# Altium project MiniDisplay.PrjPCB
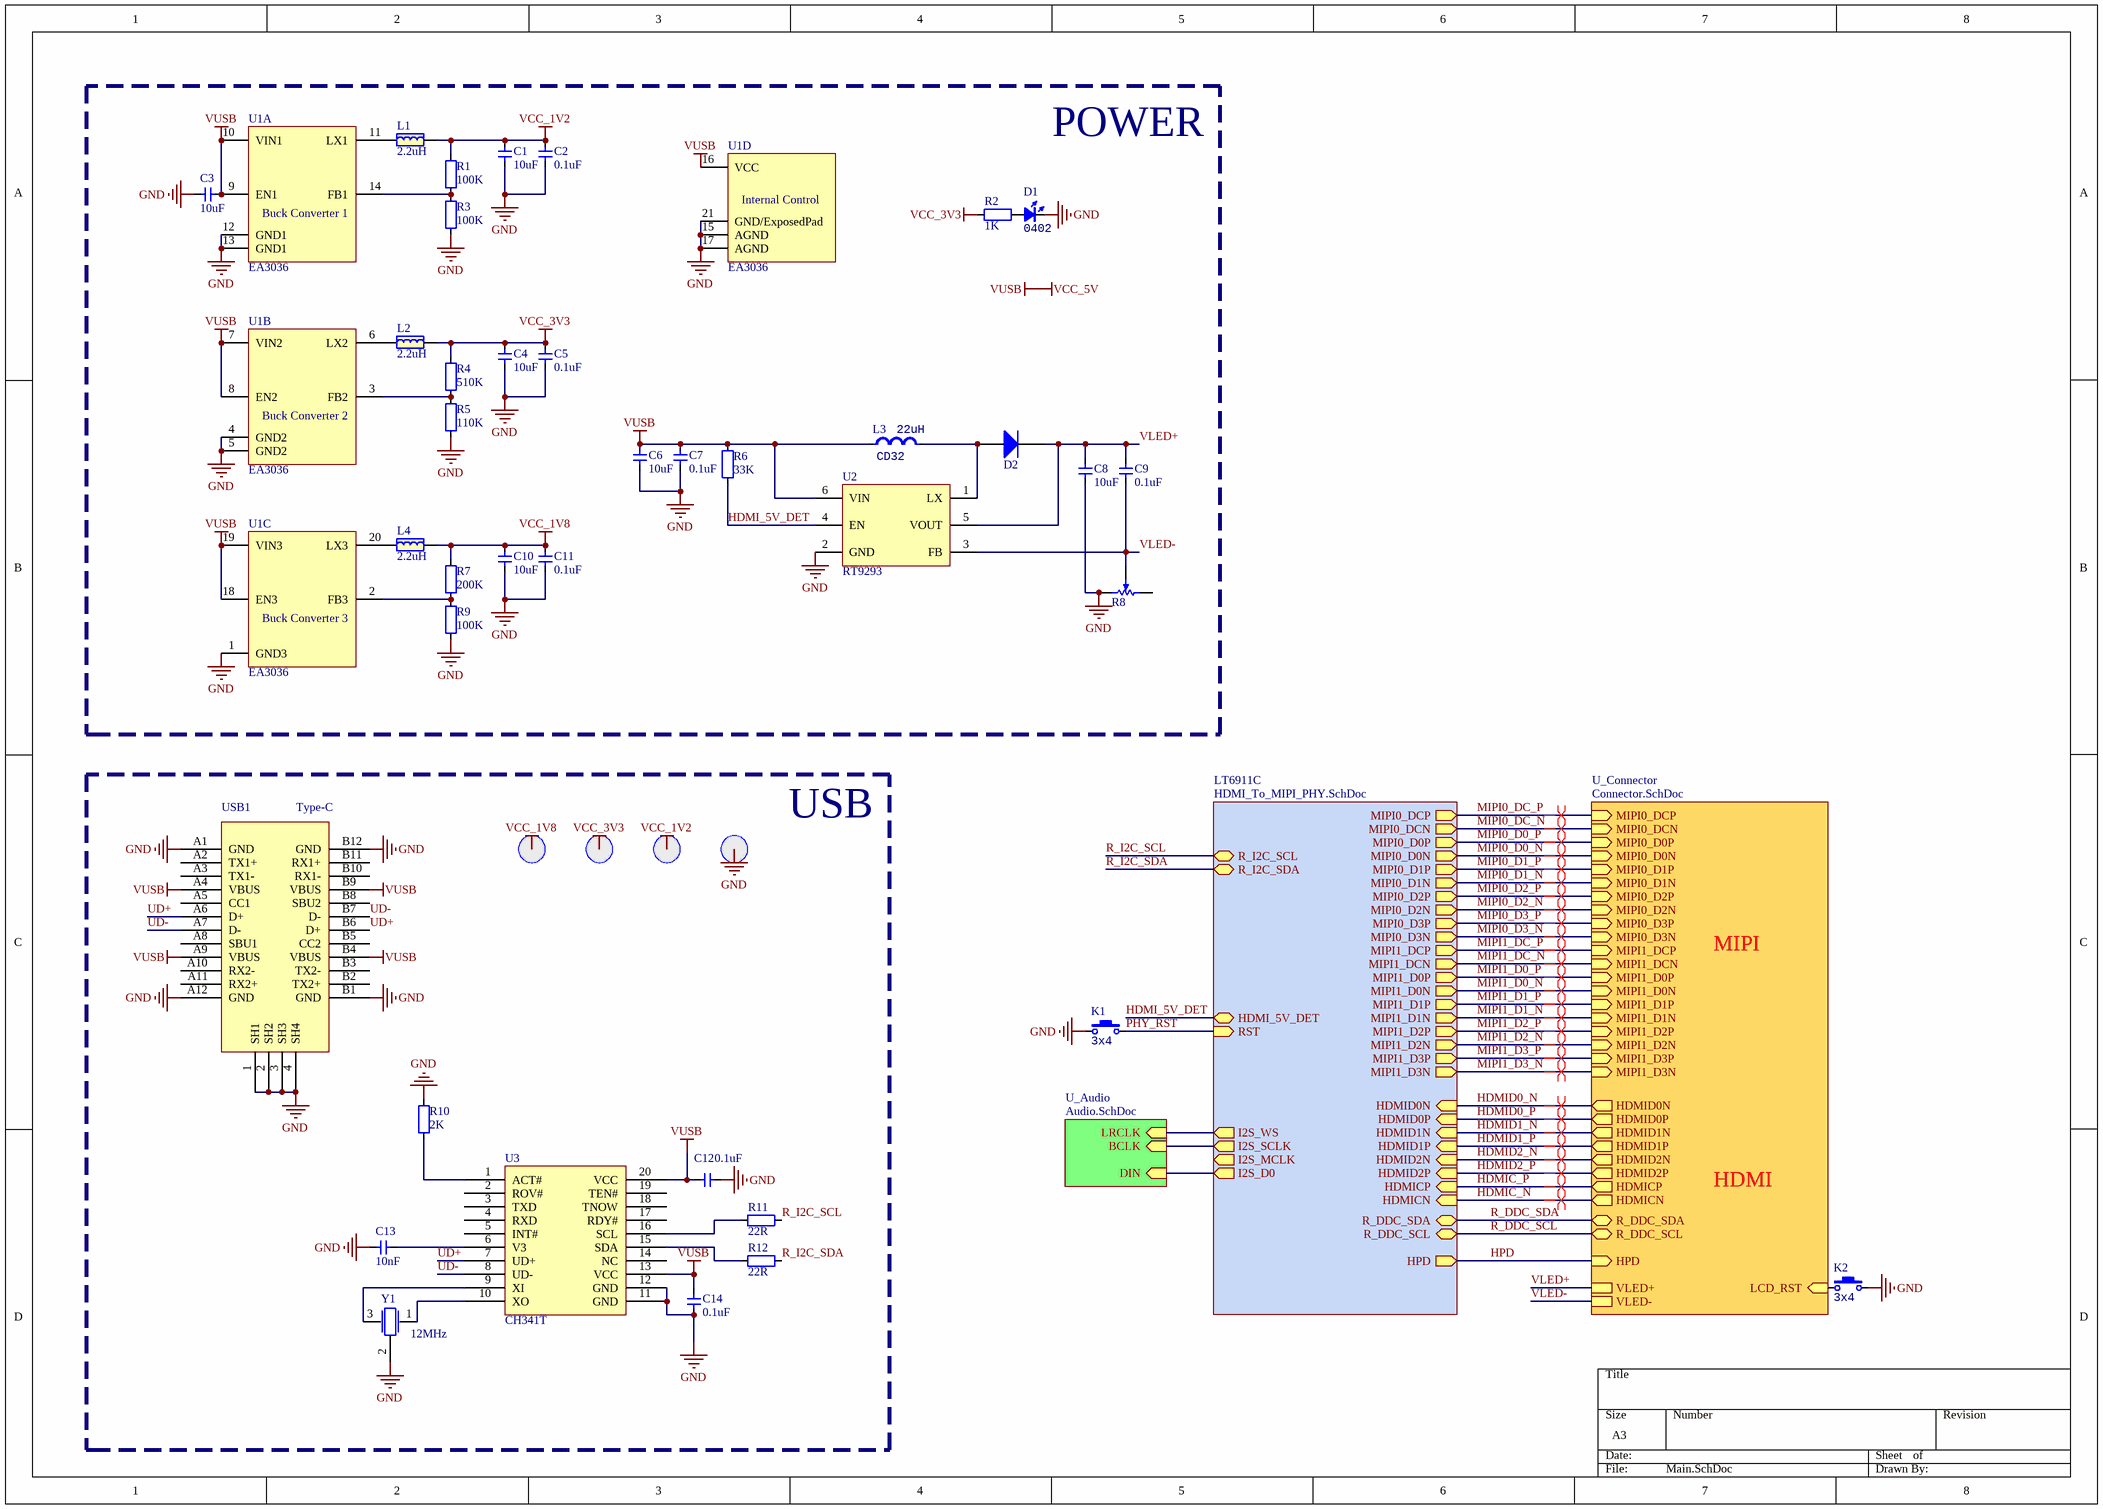
[diagram p0: Main.SchDoc]
3 sheets, 61 parts. Net scope: hierarchical (ports join the sheet entries above them; power ports are global).
Board file: MiniDisplay.PcbDoc
Sheets:
  Main.SchDoc
    LT6911C = HDMI_To_MIPI_PHY.SchDoc
    U_Connector = Connector.SchDoc

## Sheet Main.SchDoc
size A3

### Parts
C1  10uF  [CAP_0402]
C2  0.1uF  [CAP_0402]
C3  10uF  [CAP_0402]
C4  10uF  [CAP_0402]
C5  0.1uF  [CAP_0402]
C6  10uF  [CAP_0402]
C7  0.1uF  [CAP_0402]
C8  10uF  [CAP_0402]
C9  0.1uF  [CAP_0402]
C10  10uF  [CAP_0402]
C11  0.1uF  [CAP_0402]
C12  0.1uF  [CAP_0402]
C13  10nF  [CAP_0402]
C14  0.1uF  [CAP_0402]
D1  Type: 0402  [LED_0402_RED]  (hidden comment: color?)
D2  二极管-5B5817WS  [SOD-323]  (value not drawn)
K1  value 3x4  [ButtonTACT_3x4x2_180H]  (hidden comment: TACT 2P)
K2  value 3x4  [ButtonTACT_3x4x2_180H]  (hidden comment: TACT 2P)
L1  2.2uH  [2520-L]
L2  2.2uH  [2520-L]
L3  value 22uH  [IND_CD32]  (hidden comment: CD32)
L4  2.2uH  [2520-L]
R1  100K  [RES_0402]
R2  1K  [RES_0402]
R3  100K  [RES_0402]
R4  510K  [RES_0402]
R5  110K  [RES_0402]
R6  33K  [RES_0402]
R7  200K  [RES_0402]
R8  电位器-贴片  [贴片电位器 3*3]  (value not drawn)
R9  100K  [RES_0402]
R10  2K  [RES_0402]
R11  22R  [RES_0402]
R12  22R  [RES_0402]
T1  测试点  [TEST_PT]  (value not drawn)
T2  测试点  [TEST_PT]  (value not drawn)
T3  测试点  [TEST_PT]  (value not drawn)
T4  测试点  [TEST_PT]  (value not drawn)
U1  EA3036  [QFN-20]  (parts A,B,C,D of 4)
U2  RT9293  [SOT23-6]
U3  CH341T  [SSOP-20]
USB1  Type-C  [Type-C-TOP]
Y1  12MHz  [晶振-3P]

### Blocks framed on the sheet
POWER: C1-C11 D1 D2 L1-L4 R1-R9 U1 U2
USB: C12-C14 R10-R12 T1-T4 U3 USB1 Y1

### Sub-sheets
LT6911C = HDMI_To_MIPI_PHY.SchDoc: R_I2C_SDA (bidir), R_I2C_SCL (bidir), HDMID0N (in), HDMID0P (in), HDMID1N (in), HDMID1P (in), HDMID2N (in), HDMID2P (in), HDMICP (in), HDMICN (in), R_DDC_SDA (bidir), R_DDC_SCL (bidir), MIPI0_DCP (out), MIPI0_DCN (out), MIPI0_D0P (out), MIPI0_D0N (out), MIPI0_D1P (out), MIPI0_D1N (out), MIPI0_D2P (out), MIPI0_D2N (out), MIPI0_D3P (out), MIPI0_D3N (out), MIPI1_DCP (out), MIPI1_DCN (out), MIPI1_D0P (out), MIPI1_D0N (out), MIPI1_D1P (out), MIPI1_D1N (out), MIPI1_D2P (out), MIPI1_D2N (out), MIPI1_D3P (out), MIPI1_D3N (out), RST (in), I2S_SCLK (out), HPD (out), I2S_D0 (out), HDMI_5V_DET (bidir), I2S_MCLK (out), I2S_WS (out)
U_Audio = Audio.SchDoc (file not in this document): BCLK (in), LRCLK (in), DIN (in)
U_Connector = Connector.SchDoc: MIPI0_DCP (in), MIPI0_DCN (in), MIPI0_D0P (in), MIPI0_D0N (in), MIPI0_D1P (in), MIPI0_D1N (in), MIPI0_D2P (in), MIPI0_D2N (in), MIPI0_D3P (in), MIPI0_D3N (in), MIPI1_DCP (in), MIPI1_DCN (in), MIPI1_D0P (in), MIPI1_D0N (in), MIPI1_D1P (in), MIPI1_D1N (in), MIPI1_D2P (in), MIPI1_D2N (in), MIPI1_D3P (in), MIPI1_D3N (in), R_DDC_SDA (bidir), R_DDC_SCL (bidir), HDMICP (out), HDMICN (out), HDMID0N (out), HDMID2P (out), HDMID1N (out), HDMID0P (out), HDMID1P (out), HDMID2N (out), HPD (in), VLED+, VLED-, LCD_RST (in)

### Nets
GND: C1.2 C2.2 C3.1 C4.2 C5.2 C6.1 C7.1 C8.1 C10.2 C11.2 C12.2 C13.2 C14.2 D1.2(K) K1.1 K2.2 R3.1 R5.1 R8.1(+) R9.1 R10.1 T4.0 U1.1(GND3) U1.4(GND2) U1.5(GND2) U1.12(GND1) U1.13(GND1) U1.15(AGND) U1.17(AGND) U1.21(GND/ExposedPad) U2.2(GND) U3.11(GND) U3.12(GND) USB1.1(SH1) USB1.2(SH2) USB1.3(SH3) USB1.4(SH4) USB1.A1(GND) USB1.A12(GND) USB1.B1(GND) USB1.B12(GND) Y1.2
VCC_1V2: C1.1 C2.1 L1.2 R1.2 T3.0
VCC_1V8: C10.1 C11.1 L4.2 R7.2 T1.0
VCC_3V3: C4.1 C5.1 L2.2 R2.1 R4.2 T2.0
VCC_5V: C3.2 C6.2 C7.2 C12.1 C14.1 L3.1 R6.2 U1.7(VIN2) U1.8(EN2) U1.9(EN1) U1.10(VIN1) U1.16(VCC) U1.18(EN3) U1.19(VIN3) U2.6(VIN) U3.13(VCC) U3.20(VCC) USB1.A4(VBUS) USB1.A9(VBUS) USB1.B4(VBUS) USB1.B9(VBUS)  [also labelled VUSB]
HDMI_5V_DET: R6.1 U2.4(EN) ; sheet LT6911C/HDMI_5V_DET
HDMIC_N: sheet LT6911C/HDMICN, sheet U_Connector/HDMICN
HDMIC_P: sheet LT6911C/HDMICP, sheet U_Connector/HDMICP
HDMID0_N: sheet LT6911C/HDMID0N, sheet U_Connector/HDMID0N
HDMID0_P: sheet LT6911C/HDMID0P, sheet U_Connector/HDMID0P
HDMID1_N: sheet LT6911C/HDMID1N, sheet U_Connector/HDMID1N
HDMID1_P: sheet LT6911C/HDMID1P, sheet U_Connector/HDMID1P
HDMID2_N: sheet LT6911C/HDMID2N, sheet U_Connector/HDMID2N
HDMID2_P: sheet LT6911C/HDMID2P, sheet U_Connector/HDMID2P
HPD: sheet LT6911C/HPD, sheet U_Connector/HPD
MIPI0_D0_N: sheet LT6911C/MIPI0_D0N, sheet U_Connector/MIPI0_D0N
MIPI0_D0_P: sheet LT6911C/MIPI0_D0P, sheet U_Connector/MIPI0_D0P
MIPI0_D1_N: sheet LT6911C/MIPI0_D1N, sheet U_Connector/MIPI0_D1N
MIPI0_D1_P: sheet LT6911C/MIPI0_D1P, sheet U_Connector/MIPI0_D1P
MIPI0_D2_N: sheet LT6911C/MIPI0_D2N, sheet U_Connector/MIPI0_D2N
MIPI0_D2_P: sheet LT6911C/MIPI0_D2P, sheet U_Connector/MIPI0_D2P
MIPI0_D3_N: sheet LT6911C/MIPI0_D3N, sheet U_Connector/MIPI0_D3N
MIPI0_D3_P: sheet LT6911C/MIPI0_D3P, sheet U_Connector/MIPI0_D3P
MIPI0_DC_N: sheet LT6911C/MIPI0_DCN, sheet U_Connector/MIPI0_DCN
MIPI0_DC_P: sheet LT6911C/MIPI0_DCP, sheet U_Connector/MIPI0_DCP
MIPI1_D0_N: sheet LT6911C/MIPI1_D0N, sheet U_Connector/MIPI1_D0N
MIPI1_D0_P: sheet LT6911C/MIPI1_D0P, sheet U_Connector/MIPI1_D0P
MIPI1_D1_N: sheet LT6911C/MIPI1_D1N, sheet U_Connector/MIPI1_D1N
MIPI1_D1_P: sheet LT6911C/MIPI1_D1P, sheet U_Connector/MIPI1_D1P
MIPI1_D2_N: sheet LT6911C/MIPI1_D2N, sheet U_Connector/MIPI1_D2N
MIPI1_D2_P: sheet LT6911C/MIPI1_D2P, sheet U_Connector/MIPI1_D2P
MIPI1_D3_N: sheet LT6911C/MIPI1_D3N, sheet U_Connector/MIPI1_D3N
MIPI1_D3_P: sheet LT6911C/MIPI1_D3P, sheet U_Connector/MIPI1_D3P
MIPI1_DC_N: sheet LT6911C/MIPI1_DCN, sheet U_Connector/MIPI1_DCN
MIPI1_DC_P: sheet LT6911C/MIPI1_DCP, sheet U_Connector/MIPI1_DCP
PHY_RST: K1.2 ; sheet LT6911C/RST
R_DDC_SCL: sheet LT6911C/R_DDC_SCL, sheet U_Connector/R_DDC_SCL
R_DDC_SDA: sheet LT6911C/R_DDC_SDA, sheet U_Connector/R_DDC_SDA
R_I2C_SCL: R11.2 ; sheet LT6911C/R_I2C_SCL
R_I2C_SDA: R12.2 ; sheet LT6911C/R_I2C_SDA
UD+: U3.7(UD+) USB1.A6(D+) USB1.B6(D+)
UD-: U3.8(UD-) USB1.A7(D-) USB1.B7(D-)
VLED+: C8.2 C9.2 D2.2(K) U2.5(VOUT) ; sheet U_Connector/VLED+
VLED-: C9.1 R8.3(W) U2.3(FB) ; sheet U_Connector/VLED-
NetC13_1: C13.1 U3.6(V3)
NetC18_2: K2.1 ; sheet U_Connector/LCD_RST
NetD1_1: D1.1(A) R2.2
NetD2_1: D2.1(A) L3.2 U2.1(LX)
NetL1_1: L1.1 U1.11(LX1)
NetL2_1: L2.1 U1.6(LX2)
NetL4_1: L4.1 U1.20(LX3)
NetR1_1: R1.1 R3.2 U1.14(FB1)
NetR4_1: R4.1 R5.2 U1.3(FB2)
NetR7_1: R7.1 R9.2 U1.2(FB3)
NetR10_2: R10.2 U3.1(ACT#)
NetR11_1: R11.1 U3.16(SCL)
NetR12_1: R12.1 U3.15(SDA)
NetU3_9: U3.9(XI) Y1.3
NetU3_10: U3.10(XO) Y1.1
NetU*1_27: sheet LT6911C/I2S_WS, sheet U_Audio/LRCLK
NetU*1_28: sheet LT6911C/I2S_SCLK, sheet U_Audio/BCLK
NetU*1_31: sheet LT6911C/I2S_D0, sheet U_Audio/DIN

Not connected (* = marked no-connect by the designer): R8 2(-); U3 2(ROV#) 3(TXD) 4(RXD) 5(INT#) 14(NC) 17(RDY#) 18(TNOW) 19(TEN#); USB1 A2(TX1+) A3(TX1-) A5(CC1) A8(SBU1) A10(RX2-) A11(RX2+) B2(TX2+) B3(TX2-) B5(CC2) B8(SBU2) B10(RX1-) B11(RX1+)

### Layout directives
differential pair: HDMIC_N, HDMIC_P, HDMID0_N, HDMID0_P, HDMID1_N, HDMID1_P, HDMID2_N, HDMID2_P, MIPI0_D0_N, MIPI0_D0_P, MIPI0_D1_N, MIPI0_D1_P, MIPI0_D2_N, MIPI0_D2_P, MIPI0_D3_N, MIPI0_D3_P, MIPI0_DC_N, MIPI0_DC_P, MIPI1_D0_N, MIPI1_D0_P, MIPI1_D1_N, MIPI1_D1_P, MIPI1_D2_N, MIPI1_D2_P, MIPI1_D3_N, MIPI1_D3_P, MIPI1_DC_N, MIPI1_DC_P

### Notes on the sheet
- MIPI
- HDMI
- (in symbol EA3036, part A) Buck Converter 1
- (in symbol EA3036, part B) Buck Converter 2
- (in symbol EA3036, part C) Buck Converter 3
- (in symbol EA3036, part D) Internal Control

### Library data of the parts
C1-C14 = 电容-0402: Capacitor; Value: 0.1u
D1 = LED_0402: LED; Value: color?
D2 = 二极管-5B5817WS: 40V
K1 K2 = ButtonTACT_3x4x2_180: Button; type: TACT 2P
L1 L2 L4 = 电感-2520: 磁珠
L3 = Ind_CD32: Inductor; Specification: ±5% 100mA; Manufacturer: *; Type: CD32
R1-R7 R9 R10 = 电阻-0402: Resistor; Value: 22R
R11 R12 = 电阻-0402: Resistor; Value: 22R
U1 = EA3036: EA3036 is a 3CH power management IC for applications powered by one Li-Ion battery or a DC 5V adapter.
U2 = RT9293: LCD-LED Driver
USB1 = USB-Type-C-TOP
Y1 = 晶振-3Pin: 村田贴片
R8 = 电位器-贴片: Published: 17-Dec-2003; DatasheetVersion: Oct-2003; PackageReference: POT4MM-2; Publisher: Altium Limited; PackageDescription: Square Trimming Potentiometer; ComponentLink1Description: Manufacturer Link; ComponentLink1URL: http://bourns.com/2/search.html

## Sheet HDMI_To_MIPI_PHY.SchDoc
size A4
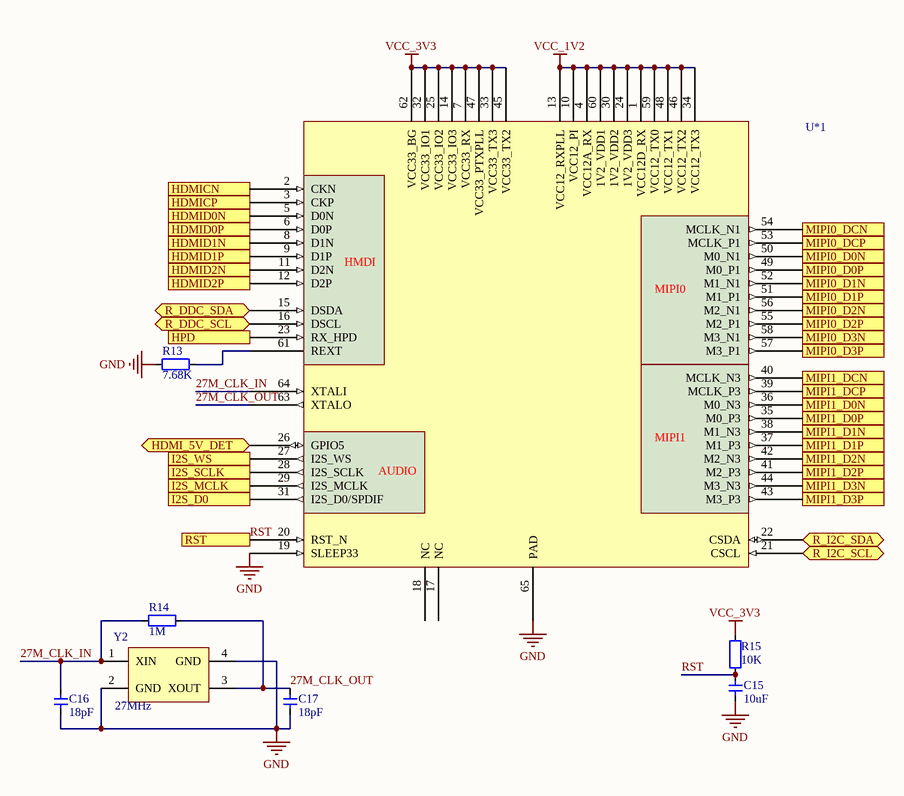
[diagram p1: HDMI_To_MIPI_PHY.SchDoc]

### Parts
C15  10uF  [CAP_0402]
C16  18pF  [CAP_0402]
C17  18pF  [CAP_0402]
R13  7.68K  [RES_0402]
R14  1M  [RES_0402]
R15  10K  [RES_0402]
U*1  LT6911C  [QFN-64-0.4mm]  (value not drawn)
Y2  27MHz  [晶振2520]

### Ports
HDMI_5V_DET (bidir), HDMICN (in), HDMICP (in), HDMID0N (in), HDMID0P (in), HDMID1N (in), HDMID1P (in), HDMID2N (in), HDMID2P (in), HPD (out), I2S_D0 (out), I2S_MCLK (out), I2S_SCLK (out), I2S_WS (out), MIPI0_D0N (out), MIPI0_D0P (out), MIPI0_D1N (out), MIPI0_D1P (out), MIPI0_D2N (out), MIPI0_D2P (out), MIPI0_D3N (out), MIPI0_D3P (out), MIPI0_DCN (out), MIPI0_DCP (out), MIPI1_D0N (out), MIPI1_D0P (out), MIPI1_D1N (out), MIPI1_D1P (out), MIPI1_D2N (out), MIPI1_D2P (out), MIPI1_D3N (out), MIPI1_D3P (out), MIPI1_DCN (out), MIPI1_DCP (out), R_DDC_SCL (bidir), R_DDC_SDA (bidir), R_I2C_SCL (bidir), R_I2C_SDA (bidir), RST (in)

### Nets
GND: C15.1 C16.1 C17.1 R13.1 U*1.19(SLEEP33) U*1.65(PAD) Y2.2(GND) Y2.4(GND)
VCC_1V2: U*1.1(VCC12D_RX) U*1.4(VCC12A_RX) U*1.10(VCC12_PI) U*1.13(VCC12_RXPLL) U*1.24(1V2_VDD3) U*1.30(1V2_VDD2) U*1.34(VCC12_TX3) U*1.46(VCC12_TX2) U*1.48(VCC12_TX1) U*1.59(VCC12_TX0) U*1.60(1V2_VDD1)
VCC_3V3: R15.2 U*1.7(VCC33_RX) U*1.14(VCC33_IO3) U*1.25(VCC33_IO2) U*1.32(VCC33_IO1) U*1.33(VCC33_TX3) U*1.45(VCC33_TX2) U*1.47(VCC33_PTXPLL) U*1.62(VCC33_BG)
27M_CLK_IN: C16.2 R14.1 U*1.64(XTALI) Y2.1(XIN)
27M_CLK_OUT: C17.2 R14.2 U*1.63(XTALO) Y2.3(XOUT)
HDMI_5V_DET: U*1.26(GPIO5) ; port HDMI_5V_DET
HDMIC_N: U*1.2(CKN) ; port HDMICN
HDMIC_P: U*1.3(CKP) ; port HDMICP
HDMID0_N: U*1.5(D0N) ; port HDMID0N
HDMID0_P: U*1.6(D0P) ; port HDMID0P
HDMID1_N: U*1.8(D1N) ; port HDMID1N
HDMID1_P: U*1.9(D1P) ; port HDMID1P
HDMID2_N: U*1.11(D2N) ; port HDMID2N
HDMID2_P: U*1.12(D2P) ; port HDMID2P
HPD: U*1.23(RX_HPD) ; port HPD
MIPI0_D0_N: U*1.50(M0_N1) ; port MIPI0_D0N
MIPI0_D0_P: U*1.49(M0_P1) ; port MIPI0_D0P
MIPI0_D1_N: U*1.52(M1_N1) ; port MIPI0_D1N
MIPI0_D1_P: U*1.51(M1_P1) ; port MIPI0_D1P
MIPI0_D2_N: U*1.56(M2_N1) ; port MIPI0_D2N
MIPI0_D2_P: U*1.55(M2_P1) ; port MIPI0_D2P
MIPI0_D3_N: U*1.58(M3_N1) ; port MIPI0_D3N
MIPI0_D3_P: U*1.57(M3_P1) ; port MIPI0_D3P
MIPI0_DC_N: U*1.54(MCLK_N1) ; port MIPI0_DCN
MIPI0_DC_P: U*1.53(MCLK_P1) ; port MIPI0_DCP
MIPI1_D0_N: U*1.36(M0_N3) ; port MIPI1_D0N
MIPI1_D0_P: U*1.35(M0_P3) ; port MIPI1_D0P
MIPI1_D1_N: U*1.38(M1_N3) ; port MIPI1_D1N
MIPI1_D1_P: U*1.37(M1_P3) ; port MIPI1_D1P
MIPI1_D2_N: U*1.42(M2_N3) ; port MIPI1_D2N
MIPI1_D2_P: U*1.41(M2_P3) ; port MIPI1_D2P
MIPI1_D3_N: U*1.44(M3_N3) ; port MIPI1_D3N
MIPI1_D3_P: U*1.43(M3_P3) ; port MIPI1_D3P
MIPI1_DC_N: U*1.40(MCLK_N3) ; port MIPI1_DCN
MIPI1_DC_P: U*1.39(MCLK_P3) ; port MIPI1_DCP
R_DDC_SCL: U*1.16(DSCL) ; port R_DDC_SCL
R_DDC_SDA: U*1.15(DSDA) ; port R_DDC_SDA
R_I2C_SCL: U*1.21(CSCL) ; port R_I2C_SCL
R_I2C_SDA: U*1.22(CSDA) ; port R_I2C_SDA
RST: C15.2 R15.1 U*1.20(RST_N) ; port RST  [project net PHY_RST]
NetR13_2: R13.2 U*1.61(REXT)
NetU*1_27: U*1.27(I2S_WS) ; port I2S_WS
NetU*1_28: U*1.28(I2S_SCLK) ; port I2S_SCLK
NetU*1_29: U*1.29(I2S_MCLK) ; port I2S_MCLK
NetU*1_31: U*1.31(I2S_D0/SPDIF) ; port I2S_D0

Not connected (* = marked no-connect by the designer): U*1 17(NC) 18(NC)

### Notes on the sheet
- (in symbol LT6911C) HMDI; MIPI0; MIPI1; AUDIO

### Library data of the parts
C15-C17 = 电容-0402: Capacitor; Value: 0.1u
R13-R15 = 电阻-0402: Resistor; Value: 22R
U*1 = LT6911C: HDMI to MIPI PHY
Y2 = 晶振-4Pin-无源: 2520无源; MF: ECS International; MP: ECS-3225S30-240-EN-TR; Package: SMD-6 ECS International; Price: 0.75 USD; Availability: Unavailable; Value: *

## Sheet Connector.SchDoc
size A4
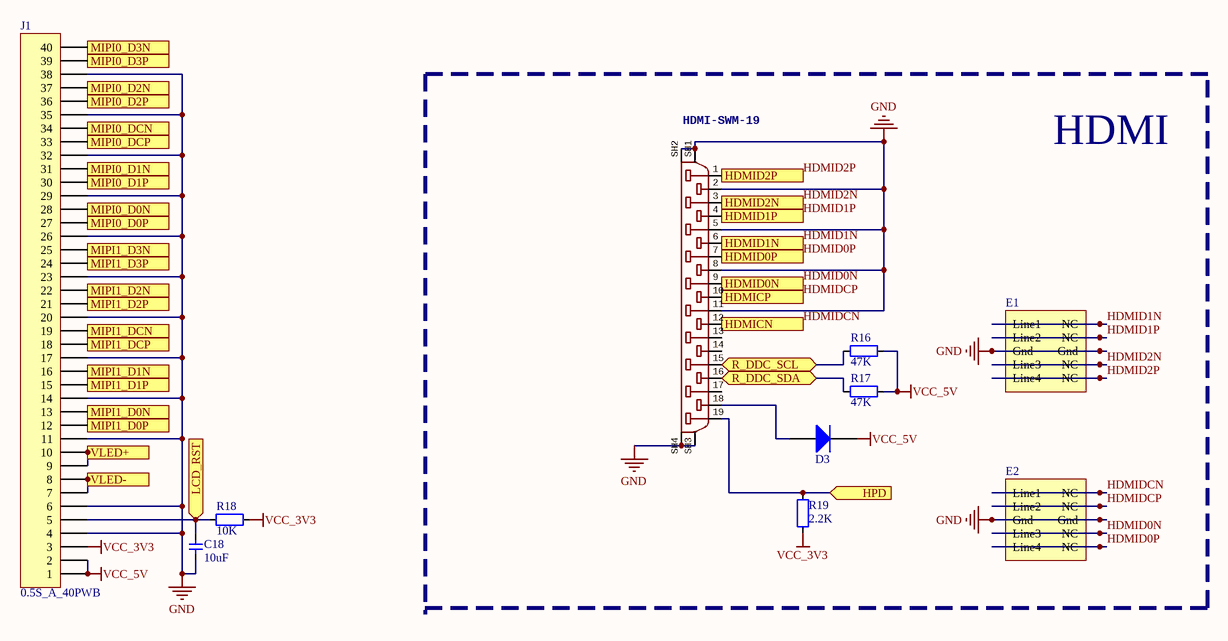
[diagram p2: Connector.SchDoc]

### Parts
C18  10uF  [CAP_0402]
D3  二极管-5B5817WS  [SOD-323]  (value not drawn)
E1  E?  [DFN-2510]  (value not drawn)
E2  E?  [DFN-2510]  (value not drawn)
HDMI?  HDMI-SWM-19  [HDMI-SWM-19]
J1  0.5S_A_40PWB  [FFC_0.5_40]
R16  47K  [RES_0402]
R17  47K  [RES_0402]
R18  10K  [RES_0402]
R19  2.2K  [RES_0402]

### Ports
HDMICN (out), HDMICP (out), HDMID0N (out), HDMID0P (out), HDMID1N (out), HDMID1P (out), HDMID2N (out), HDMID2P (out), HPD (in), LCD_RST (in), MIPI0_D0N (in), MIPI0_D0P (in), MIPI0_D1N (in), MIPI0_D1P (in), MIPI0_D2N (in), MIPI0_D2P (in), MIPI0_D3N (in), MIPI0_D3P (in), MIPI0_DCN (in), MIPI0_DCP (in), MIPI1_D0N (in), MIPI1_D0P (in), MIPI1_D1N (in), MIPI1_D1P (in), MIPI1_D2N (in), MIPI1_D2P (in), MIPI1_D3N (in), MIPI1_D3P (in), MIPI1_DCN (in), MIPI1_DCP (in), R_DDC_SCL (bidir), R_DDC_SDA (bidir), VLED+, VLED-

### Nets
GND: C18.1 E1.3(Gnd) E1.8(Gnd) E2.3(Gnd) E2.8(Gnd) HDMI?.2 HDMI?.5 HDMI?.8 HDMI?.11 HDMI?.SH1 HDMI?.SH2 HDMI?.SH3 HDMI?.SH4 J1.4 J1.6 J1.11 J1.14 J1.17 J1.20 J1.23 J1.26 J1.29 J1.32 J1.35 J1.38
VCC_3V3: J1.3 R18.2 R19.1
VCC_5V: D3.2(K) J1.1 J1.2 R16.2 R17.2
HDMID0N: E2.4(Line3) E2.7(NC) HDMI?.9 ; port HDMID0N  [project net HDMID0_N]
HDMID0P: E2.5(Line4) E2.6(NC) HDMI?.7 ; port HDMID0P  [project net HDMID0_P]
HDMID1N: E1.1(Line1) E1.10(NC) HDMI?.6 ; port HDMID1N  [project net HDMID1_N]
HDMID1P: E1.2(Line2) E1.9(NC) HDMI?.4 ; port HDMID1P  [project net HDMID1_P]
HDMID2N: E1.4(Line3) E1.7(NC) HDMI?.3 ; port HDMID2N  [project net HDMID2_N]
HDMID2P: E1.5(Line4) E1.6(NC) HDMI?.1 ; port HDMID2P  [project net HDMID2_P]
HDMIDCN: E2.1(Line1) E2.10(NC) HDMI?.12 ; port HDMICN  [project net HDMIC_N]
HDMIDCP: E2.2(Line2) E2.9(NC) HDMI?.10 ; port HDMICP  [project net HDMIC_P]
HPD: HDMI?.19 R19.2 ; port HPD
MIPI0_D0_N: J1.28 ; port MIPI0_D0N
MIPI0_D0_P: J1.27 ; port MIPI0_D0P
MIPI0_D1_N: J1.31 ; port MIPI0_D1N
MIPI0_D1_P: J1.30 ; port MIPI0_D1P
MIPI0_D2_N: J1.37 ; port MIPI0_D2N
MIPI0_D2_P: J1.36 ; port MIPI0_D2P
MIPI0_D3_N: J1.40 ; port MIPI0_D3N
MIPI0_D3_P: J1.39 ; port MIPI0_D3P
MIPI0_DC_N: J1.34 ; port MIPI0_DCN
MIPI0_DC_P: J1.33 ; port MIPI0_DCP
MIPI1_D0_N: J1.13 ; port MIPI1_D0N
MIPI1_D0_P: J1.12 ; port MIPI1_D0P
MIPI1_D1_N: J1.16 ; port MIPI1_D1N
MIPI1_D1_P: J1.15 ; port MIPI1_D1P
MIPI1_D2_N: J1.22 ; port MIPI1_D2N
MIPI1_D2_P: J1.21 ; port MIPI1_D2P
MIPI1_D3_N: J1.25 ; port MIPI1_D3N
MIPI1_D3_P: J1.24 ; port MIPI1_D3P
MIPI1_DC_N: J1.19 ; port MIPI1_DCN
MIPI1_DC_P: J1.18 ; port MIPI1_DCP
R_DDC_SCL: HDMI?.15 R16.1 ; port R_DDC_SCL
R_DDC_SDA: HDMI?.16 R17.1 ; port R_DDC_SDA
VLED+: J1.9 J1.10 ; port VLED+
VLED-: J1.7 J1.8 ; port VLED-
NetC18_2: C18.2 J1.5 R18.1 ; port LCD_RST
NetD3_1: D3.1(A) HDMI?.18

Not connected (* = marked no-connect by the designer): HDMI? 13 14 17

### Notes on the sheet
- HDMI

### Library data of the parts
C18 = 电容-0402: Capacitor; Value: 0.1u
D3 = 二极管-5B5817WS: 40V
E1 E2 = AZ1045-04F
HDMI? = HDMI-MC34931HDMI-SWM-19
J1 = FPC40-0.5mm: Header, 40-Pin; LatestRevisionDate: 17-Jul-2002; LatestRevisionNote: Re-released for DXP Platform.; Publisher: Altium Limited
R16-R19 = 电阻-0402: Resistor; Value: 22R

## Nets that join several sheets
GND: Main (42 pins), HDMI_To_MIPI_PHY (8 pins), Connector (25 pins)
VCC_1V2: Main (5 pins), HDMI_To_MIPI_PHY (11 pins)
VCC_3V3: Main (6 pins), HDMI_To_MIPI_PHY (9 pins), Connector (J1.3 R18.2 R19.1)
VCC_5V: Main (21 pins), Connector (5 pins)
HDMI_5V_DET: Main (R6.1 U2.4), HDMI_To_MIPI_PHY (U*1.26)
HDMIC_N: HDMI_To_MIPI_PHY (U*1.2), Connector (E2.1 E2.10 HDMI?.12)
HDMIC_P: HDMI_To_MIPI_PHY (U*1.3), Connector (E2.2 E2.9 HDMI?.10)
HDMID0_N: HDMI_To_MIPI_PHY (U*1.5), Connector (E2.4 E2.7 HDMI?.9)
HDMID0_P: HDMI_To_MIPI_PHY (U*1.6), Connector (E2.5 E2.6 HDMI?.7)
HDMID1_N: HDMI_To_MIPI_PHY (U*1.8), Connector (E1.1 E1.10 HDMI?.6)
HDMID1_P: HDMI_To_MIPI_PHY (U*1.9), Connector (E1.2 E1.9 HDMI?.4)
HDMID2_N: HDMI_To_MIPI_PHY (U*1.11), Connector (E1.4 E1.7 HDMI?.3)
HDMID2_P: HDMI_To_MIPI_PHY (U*1.12), Connector (E1.5 E1.6 HDMI?.1)
HPD: HDMI_To_MIPI_PHY (U*1.23), Connector (HDMI?.19 R19.2)
MIPI0_D0_N: HDMI_To_MIPI_PHY (U*1.50), Connector (J1.28)
MIPI0_D0_P: HDMI_To_MIPI_PHY (U*1.49), Connector (J1.27)
MIPI0_D1_N: HDMI_To_MIPI_PHY (U*1.52), Connector (J1.31)
MIPI0_D1_P: HDMI_To_MIPI_PHY (U*1.51), Connector (J1.30)
MIPI0_D2_N: HDMI_To_MIPI_PHY (U*1.56), Connector (J1.37)
MIPI0_D2_P: HDMI_To_MIPI_PHY (U*1.55), Connector (J1.36)
MIPI0_D3_N: HDMI_To_MIPI_PHY (U*1.58), Connector (J1.40)
MIPI0_D3_P: HDMI_To_MIPI_PHY (U*1.57), Connector (J1.39)
MIPI0_DC_N: HDMI_To_MIPI_PHY (U*1.54), Connector (J1.34)
MIPI0_DC_P: HDMI_To_MIPI_PHY (U*1.53), Connector (J1.33)
MIPI1_D0_N: HDMI_To_MIPI_PHY (U*1.36), Connector (J1.13)
MIPI1_D0_P: HDMI_To_MIPI_PHY (U*1.35), Connector (J1.12)
MIPI1_D1_N: HDMI_To_MIPI_PHY (U*1.38), Connector (J1.16)
MIPI1_D1_P: HDMI_To_MIPI_PHY (U*1.37), Connector (J1.15)
MIPI1_D2_N: HDMI_To_MIPI_PHY (U*1.42), Connector (J1.22)
MIPI1_D2_P: HDMI_To_MIPI_PHY (U*1.41), Connector (J1.21)
MIPI1_D3_N: HDMI_To_MIPI_PHY (U*1.44), Connector (J1.25)
MIPI1_D3_P: HDMI_To_MIPI_PHY (U*1.43), Connector (J1.24)
MIPI1_DC_N: HDMI_To_MIPI_PHY (U*1.40), Connector (J1.19)
MIPI1_DC_P: HDMI_To_MIPI_PHY (U*1.39), Connector (J1.18)
NetC18_2: Main (K2.1), Connector (C18.2 J1.5 R18.1)
PHY_RST: Main (K1.2), HDMI_To_MIPI_PHY (C15.2 R15.1 U*1.20)
R_DDC_SCL: HDMI_To_MIPI_PHY (U*1.16), Connector (HDMI?.15 R16.1)
R_DDC_SDA: HDMI_To_MIPI_PHY (U*1.15), Connector (HDMI?.16 R17.1)
R_I2C_SCL: Main (R11.2), HDMI_To_MIPI_PHY (U*1.21)
R_I2C_SDA: Main (R12.2), HDMI_To_MIPI_PHY (U*1.22)
VLED+: Main (C8.2 C9.2 D2.2 U2.5), Connector (J1.9 J1.10)
VLED-: Main (C9.1 R8.3 U2.3), Connector (J1.7 J1.8)